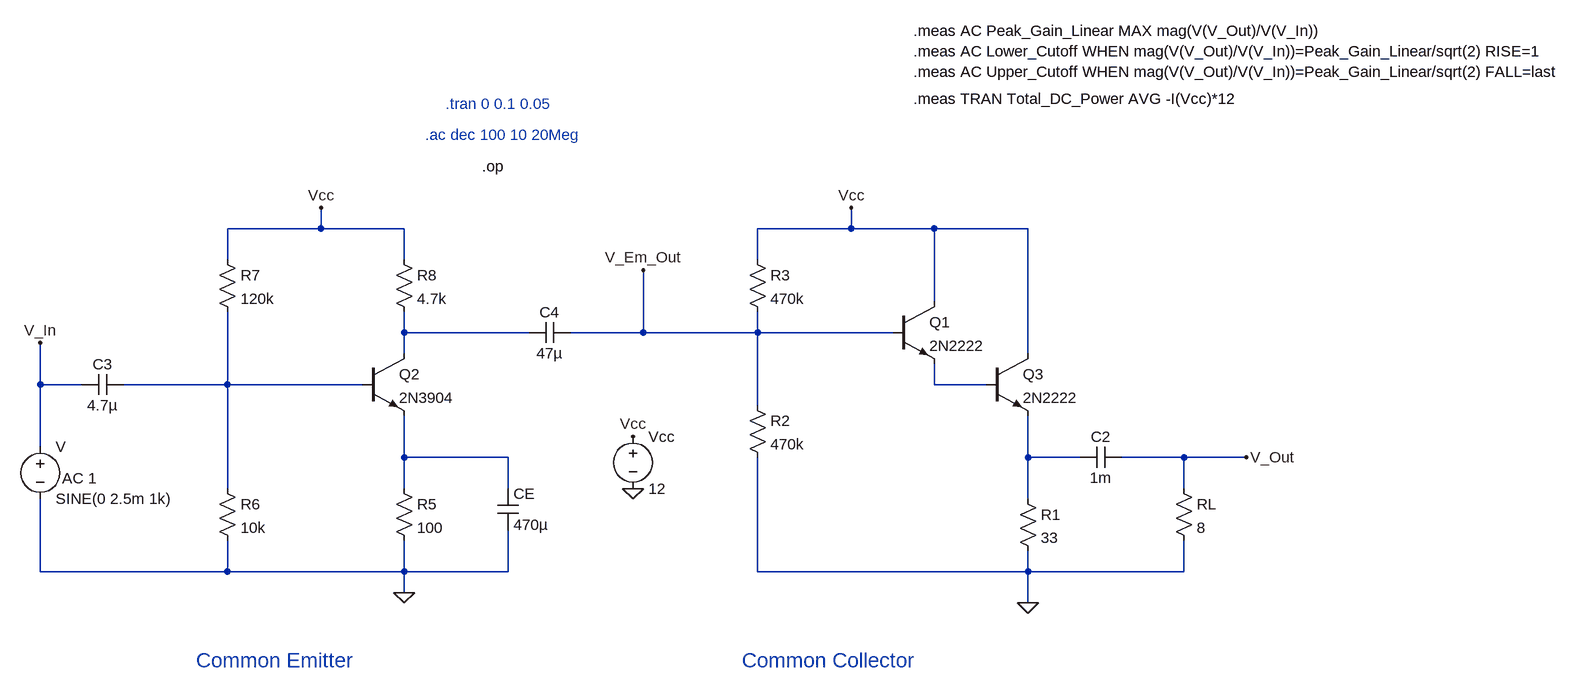
[diagram p0: schematic Multi_Stage_Gain.asc]
Multi_Stage_Gain.asc, the LTspice schematic file:
Version 4.1
SHEET 1 1816 704
WIRE -1296 0 -1296 -32
WIRE -1296 0 -1440 0
WIRE -1168 0 -1296 0
WIRE -480 0 -480 -32
WIRE -480 0 -624 0
WIRE -352 0 -480 0
WIRE -208 0 -352 0
WIRE -1440 48 -1440 0
WIRE -1168 48 -1168 0
WIRE -624 48 -624 0
WIRE -352 112 -352 0
WIRE -1168 160 -1168 128
WIRE -976 160 -1168 160
WIRE -800 160 -800 64
WIRE -800 160 -912 160
WIRE -624 160 -624 128
WIRE -624 160 -800 160
WIRE -416 160 -624 160
WIRE -1168 192 -1168 160
WIRE -208 192 -208 0
WIRE -1728 240 -1728 176
WIRE -1664 240 -1728 240
WIRE -1440 240 -1440 128
WIRE -1440 240 -1600 240
WIRE -1232 240 -1440 240
WIRE -352 240 -352 208
WIRE -272 240 -352 240
WIRE -624 272 -624 160
WIRE -1728 336 -1728 240
WIRE -1168 352 -1168 288
WIRE -1008 352 -1168 352
WIRE -208 352 -208 288
WIRE -128 352 -208 352
WIRE 32 352 -64 352
WIRE 128 352 32 352
WIRE -1440 400 -1440 240
WIRE -1168 400 -1168 352
WIRE -1008 400 -1008 352
WIRE 32 400 32 352
WIRE -208 416 -208 352
WIRE -1728 528 -1728 416
WIRE -1440 528 -1440 480
WIRE -1440 528 -1728 528
WIRE -1168 528 -1168 480
WIRE -1168 528 -1440 528
WIRE -1008 528 -1008 464
WIRE -1008 528 -1168 528
WIRE -624 528 -624 352
WIRE -208 528 -208 496
WIRE -208 528 -624 528
WIRE 32 528 32 480
WIRE 32 528 -208 528
WIRE -1168 560 -1168 528
WIRE -208 576 -208 528
FLAG -208 576 0
FLAG -480 -32 Vcc
FLAG 128 352 V_Out
FLAG -1168 560 0
FLAG -816 400 0
FLAG -816 320 Vcc
FLAG -1296 -32 Vcc
FLAG -800 64 V_Em_Out
FLAG -1728 176 V_In
SYMBOL npn -416 112 R0
SYMATTR InstName Q1
SYMATTR Value 2N2222
SYMBOL res -224 400 R0
SYMATTR InstName R1
SYMATTR Value 33
SYMBOL res -640 256 R0
SYMATTR InstName R2
SYMATTR Value 470k
SYMBOL res -640 32 R0
SYMATTR InstName R3
SYMATTR Value 470k
SYMBOL cap -64 336 R90
WINDOW 0 0 32 VBottom 2
WINDOW 3 32 32 VTop 2
SYMATTR InstName C2
SYMATTR Value 1m
SYMBOL res 16 384 R0
SYMATTR InstName RL
SYMATTR Value 8
SYMBOL npn -1232 192 R0
SYMATTR InstName Q2
SYMATTR Value 2N3904
SYMBOL voltage -1728 320 R0
WINDOW 123 34 64 Left 2
WINDOW 39 0 0 Left 0
SYMATTR Value2 AC 1
SYMATTR InstName V
SYMATTR Value SINE(0 2.5m 1k)
SYMBOL cap -1600 224 R90
WINDOW 0 0 32 VBottom 2
WINDOW 3 32 32 VTop 2
SYMATTR InstName C3
SYMATTR Value 4.7µ
SYMBOL res -1184 384 R0
SYMATTR InstName R5
SYMATTR Value 100
SYMBOL res -1456 384 R0
SYMATTR InstName R6
SYMATTR Value 10k
SYMBOL res -1456 32 R0
SYMATTR InstName R7
SYMATTR Value 120k
SYMBOL res -1184 32 R0
SYMATTR InstName R8
SYMATTR Value 4.7k
SYMBOL voltage -816 304 R0
WINDOW 123 0 0 Left 0
WINDOW 39 0 0 Left 0
SYMATTR InstName Vcc
SYMATTR Value 12
SYMBOL cap -912 144 R90
WINDOW 0 0 32 VBottom 2
WINDOW 3 32 32 VTop 2
SYMATTR InstName C4
SYMATTR Value 47µ
SYMBOL cap -1024 400 R0
SYMATTR InstName CE
SYMATTR Value 470µ
SYMBOL npn -272 192 R0
SYMATTR InstName Q3
SYMATTR Value 2N2222
TEXT -648 664 Left 3 ;Common Collector
TEXT -1488 664 Left 3 ;Common Emitter
TEXT -1136 -144 Left 2 ;.ac dec 100 10 20Meg
TEXT -1104 -192 Left 2 ;.tran 0 0.1 0.05
TEXT -384 -200 Left 2 !.meas TRAN Total_DC_Power AVG -I(Vcc)*12
TEXT -384 -304 Left 2 !.meas AC Peak_Gain_Linear MAX mag(V(V_Out)/V(V_In))\n.meas AC Lower_Cutoff WHEN mag(V(V_Out)/V(V_In))=Peak_Gain_Linear/sqrt(2) RISE=1\n.meas AC Upper_Cutoff WHEN mag(V(V_Out)/V(V_In))=Peak_Gain_Linear/sqrt(2) FALL=last
TEXT -1048 -96 Left 2 !.op

The netlist it stands for:
* Multi_Stage_Gain.asc
Q1 Vcc V_Em_Out N003 0 2N2222
R1 N005 0 33
R2 V_Em_Out 0 470k
R3 Vcc V_Em_Out 470k
C2 V_Out N005 1m
RL V_Out 0 8
Q2 N001 N002 N004 0 2N3904
V V_In 0 SINE(0 2.5m 1k) AC 1
C3 N002 V_In 4.7µ
R5 N004 0 100
R6 N002 0 10k
R7 Vcc N002 120k
R8 Vcc N001 4.7k
Vcc Vcc 0 12
C4 V_Em_Out N001 47µ
CE N004 0 470µ
Q3 Vcc N003 N005 0 2N2222
.model NPN NPN
.model PNP PNP
.lib standard.bjt
* Common Collector
* Common Emitter
* .ac dec 100 10 20Meg
* .tran 0 0.1 0.05
.meas TRAN Total_DC_Power AVG -I(Vcc)*12
.meas AC Peak_Gain_Linear MAX mag(V(V_Out)/V(V_In))
.meas AC Lower_Cutoff WHEN mag(V(V_Out)/V(V_In))=Peak_Gain_Linear/sqrt(2) RISE=1
.meas AC Upper_Cutoff WHEN mag(V(V_Out)/V(V_In))=Peak_Gain_Linear/sqrt(2) FALL=last
.op
.backanno
.end